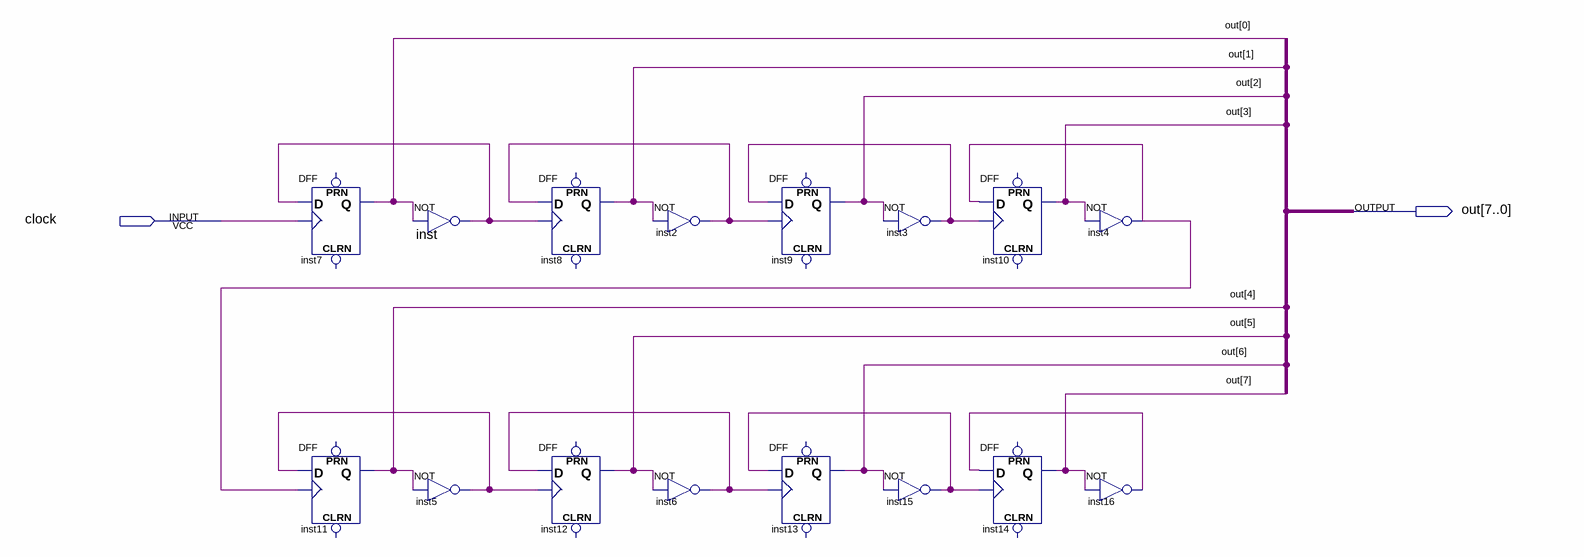
[diagram p0: schematic sheet]
// Quartus schematic counter8.bdf as structural Verilog: 16 symbols, 2 pins
module counter8 (
  input  clock,
  output [7:0] out
);

  wire inst2_out, inst3_out, inst4_out, inst5_out, inst6_out, inst15_out, inst16_out, inst_out;

  DFF inst7 (.CLK(clock), .D(inst_out), .Q(out[0]));  // open: CLRN, PRN
  DFF inst11 (.CLK(inst4_out), .D(inst5_out), .Q(out[4]));  // open: CLRN, PRN
  not inst (inst_out, out[0]);
  not inst5 (inst5_out, out[4]);
  DFF inst8 (.CLK(inst_out), .D(inst2_out), .Q(out[1]));  // open: CLRN, PRN
  DFF inst12 (.CLK(inst5_out), .D(inst6_out), .Q(out[5]));  // open: CLRN, PRN
  not inst2 (inst2_out, out[1]);
  not inst6 (inst6_out, out[5]);
  DFF inst9 (.CLK(inst2_out), .D(inst3_out), .Q(out[2]));  // open: CLRN, PRN
  DFF inst13 (.CLK(inst6_out), .D(inst15_out), .Q(out[6]));  // open: CLRN, PRN
  not inst3 (inst3_out, out[2]);
  not inst15 (inst15_out, out[6]);
  DFF inst10 (.CLK(inst3_out), .D(inst4_out), .Q(out[3]));  // open: CLRN, PRN
  DFF inst14 (.CLK(inst15_out), .D(inst16_out), .Q(out[7]));  // open: CLRN, PRN
  not inst4 (inst4_out, out[3]);
  not inst16 (inst16_out, out[7]);
endmodule
